# EAGLE design NAV_Doska_1 (EAGLE 7.2.0)
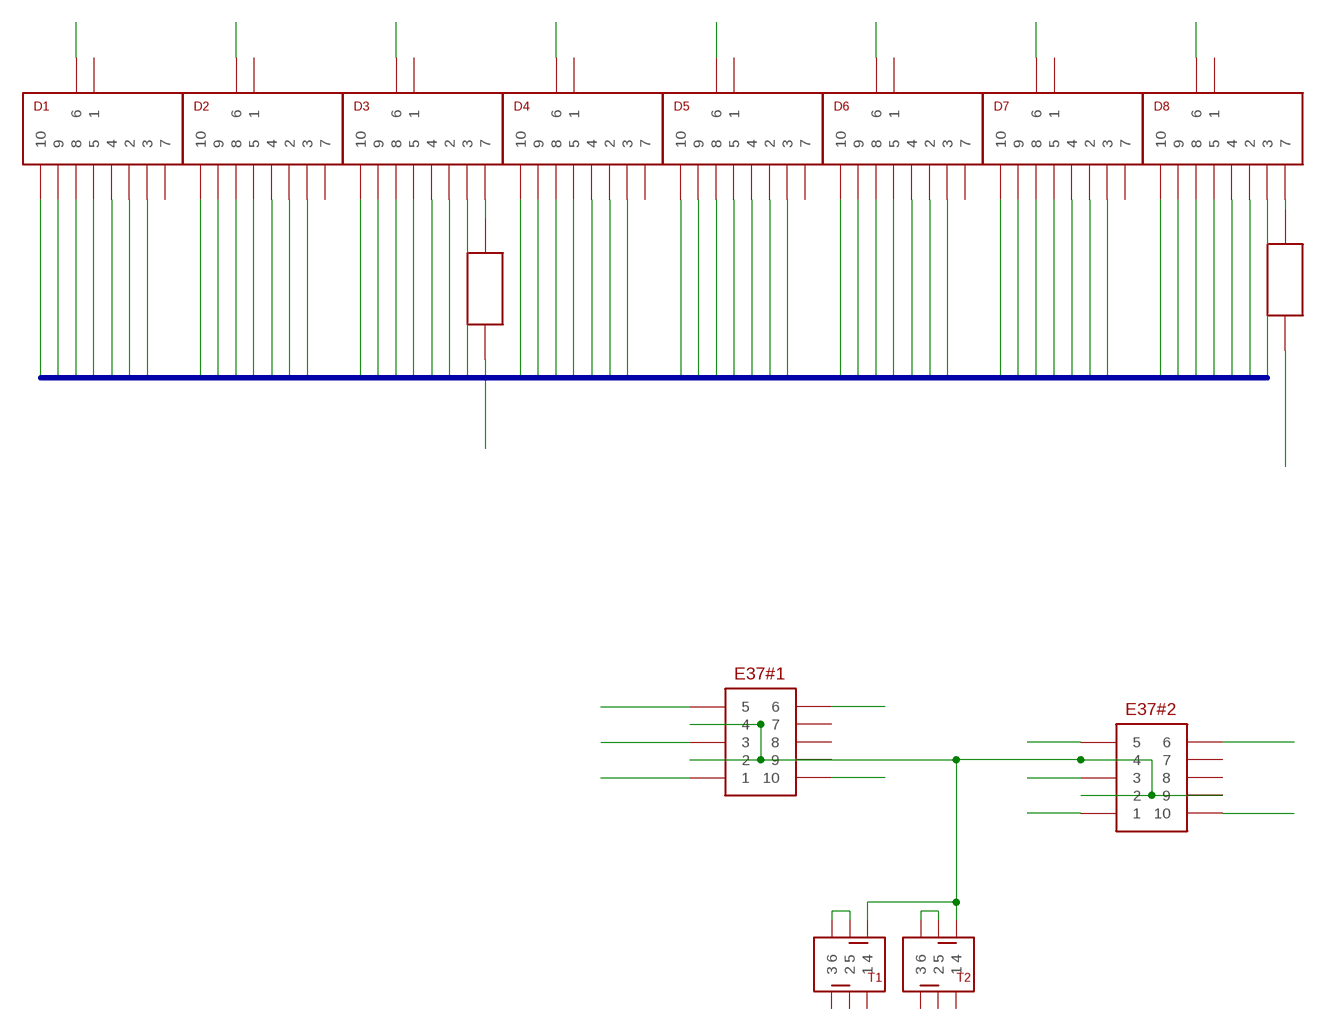
[diagram p0: schematic, sheet 1, part 1 of 2]
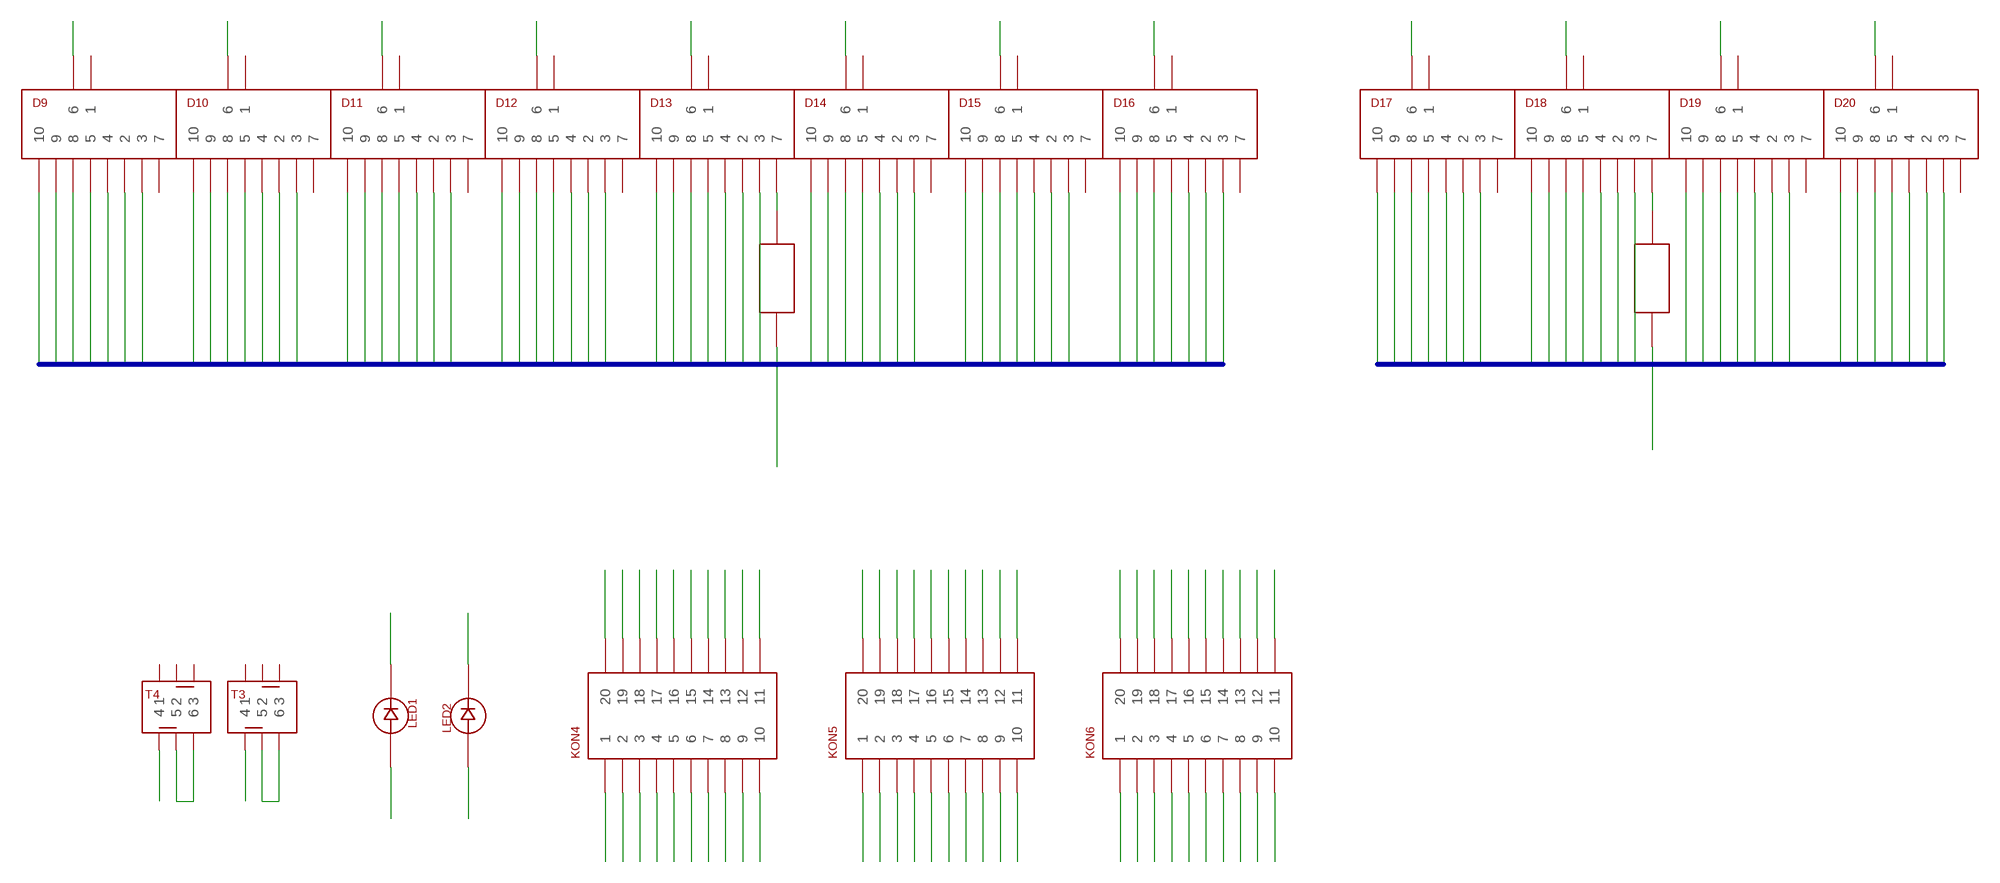
[diagram p1: schematic, sheet 1, part 2 of 2]

## Parts
D1  SA3611EWA  [SA3611EWA]
D2  SA3611EWA  [SA3611EWA]
D3  SA3611EWA  [SA3611EWA]
D4  SA3611EWA  [SA3611EWA]
D5  SA3611EWA  [SA3611EWA]
D6  SA3611EWA  [SA3611EWA]
D7  SA3611EWA  [SA3611EWA]
D8  SA3611EWA  [SA3611EWA]
D9  SA3611EWA  [SA3611EWA]
D10  SA3611EWA  [SA3611EWA]
D11  SA3611EWA  [SA3611EWA]
D12  SA3611EWA  [SA3611EWA]
D13  SA3611EWA  [SA3611EWA]
D14  SA3611EWA  [SA3611EWA]
D15  SA3611EWA  [SA3611EWA]
D16  SA3611EWA  [SA3611EWA]
D17  SA3611EWA  [SA3611EWA]
D18  SA3611EWA  [SA3611EWA]
D19  SA3611EWA  [SA3611EWA]
D20  SA3611EWA  [SA3611EWA]
E37#1  ELMA_E37  [ELMA_E37]
E37#2  ELMA_E37  [ELMA_E37]
KON4  LISTA_2X10  [LISTA_2X10]
KON5  LISTA_2X10  [LISTA_2X10]
KON6  LISTA_2X10  [LISTA_2X10]
LED1  LED_5MM  [LED_5MM]
LED2  LED_5MM  [LED_5MM]
T1  P1-0S  [P1-0S]
T2  P1-0S  [P1-0S]
T3  P1-0S  [P1-0S]
T4  P1-0S  [P1-0S]
U$1  REZISTOR  [REZISTOR]
U$2  REZISTOR  [REZISTOR]
U$3  REZISTOR  [REZISTOR]
U$4  REZISTOR  [REZISTOR]

## Nets
D1: D1.6 KON4.1
D2: D2.6 KON4.2
D3: D3.6 KON4.9
D4: D4.6 KON4.6
D5: D5.6 KON4.3
D6: D6.6 KON4.8
D7: D7.6 KON4.7
D8: D8.6 KON4.4
D9: D9.6 KON5.1
D10: D10.6 KON5.2
D11: D11.6 KON5.9
D12: D12.6 KON5.6
D13: D13.6 KON5.3
D14: D14.6 KON5.8
D15: D15.6 KON5.7
D16: D16.6 KON5.4
D17: D17.6 KON6.1
D18: D18.6 KON6.2
D19: D19.6 KON6.9
D20: D20.6 KON6.6
DRIVER1_SEG2: D1.2 D2.2 D3.2 D4.2 D5.2 D6.2 D7.2 D8.2 KON4.10
DRIVER1_SEG3: D1.3 D2.3 D3.3 D4.3 D5.3 D6.3 D7.3 D8.3 KON4.12
DRIVER1_SEG4: D1.4 D2.4 D3.4 D4.4 D5.4 D6.4 D7.4 D8.4 KON4.15
DRIVER1_SEG5: D1.5 D2.5 D3.5 D4.5 D5.5 D6.5 D7.5 D8.5 KON4.16
DRIVER1_SEG8: D1.8 D2.8 D3.8 D4.8 D5.8 D6.8 D7.8 D8.8 KON4.14
DRIVER1_SEG9: D1.9 D2.9 D3.9 D4.9 D5.9 D6.9 D7.9 D8.9 KON4.11
DRIVER1_SEG10: D1.10 D2.10 D3.10 D4.10 D5.10 D6.10 D7.10 D8.10 KON4.13
DRIVER2_SEG2: D9.2 D10.2 D11.2 D12.2 D13.2 D14.2 D15.2 D16.2 KON5.10
DRIVER2_SEG3: D9.3 D10.3 D11.3 D12.3 D13.3 D14.3 D15.3 D16.3 KON5.12
DRIVER2_SEG4: D9.4 D10.4 D11.4 D12.4 D13.4 D14.4 D15.4 D16.4 KON5.15
DRIVER2_SEG5: D9.5 D10.5 D11.5 D12.5 D13.5 D14.5 D15.5 D16.5 KON5.16
DRIVER2_SEG8: D9.8 D10.8 D11.8 D12.8 D13.8 D14.8 D15.8 D16.8 KON5.14
DRIVER2_SEG9: D9.9 D10.9 D11.9 D12.9 D13.9 D14.9 D15.9 D16.9 KON5.11
DRIVER2_SEG10: D9.10 D10.10 D11.10 D12.10 D13.10 D14.10 D15.10 D16.10 KON5.13
DRIVER3_SEG2: D17.2 D18.2 D19.2 D20.2 KON6.10
DRIVER3_SEG3: D17.3 D18.3 D19.3 D20.3 KON6.12
DRIVER3_SEG4: D17.4 D18.4 D19.4 D20.4 KON6.15
DRIVER3_SEG5: D17.5 D18.5 D19.5 D20.5 KON6.16 LED1.P$2 LED2.P$2
DRIVER3_SEG8: D17.8 D18.8 D19.8 D20.8 KON6.14
DRIVER3_SEG9: D17.9 D18.9 D19.9 D20.9 KON6.11
DRIVER3_SEG10: D17.10 D18.10 D19.10 D20.10 KON6.13
E37#1_1: E37#1.1 KON4.17
E37#1_3: E37#1.3 KON4.18
E37#1_5: E37#1.5 KON4.20
E37#1_6: E37#1.6 KON4.19
E37#1_10: E37#1.10 KON4.5
E37#2_1: E37#2.1 KON6.17
E37#2_3: E37#2.3 KON6.18
E37#2_5: E37#2.5 KON6.20
E37#2_6: E37#2.6 KON6.19
E37#2_10: E37#2.10 KON6.5
GND: E37#1.2 E37#1.4 E37#1.9 E37#2.2 E37#2.4 E37#2.9 KON5.5 T1.4 T2.4 T3.5 T3.6 T4.5 T4.6 U$1.P$1 U$2.P$1 U$3.P$1 U$4.P$1
LED1: KON6.3 LED1.P$1
LED2: KON6.8 LED2.P$1
N$2: D3.7 U$4.P$2
N$3: D18.7 U$2.P$2
N$4: D13.7 U$1.P$2
N$5: D8.7 U$3.P$2
N$33: KON6.4
N$42: KON6.7
T1: KON5.20 T1.5 T1.6
T2: KON5.19 T2.5 T2.6
T3: KON5.18 T3.4
T4: KON5.17 T4.4
Unconnected: D1.1 D1.7 D2.1 D2.7 D3.1 D4.1 D4.7 D5.1 D5.7 D6.1 D6.7 D7.1 D7.7 D8.1 D9.1 D9.7 D10.1 D10.7 D11.1 D11.7 D12.1 D12.7 D13.1 D14.1 D14.7 D15.1 D15.7 D16.1 D16.7 D17.1 D17.7 D18.1 D19.1 D19.7 D20.1 D20.7 E37#1.7 E37#1.8 E37#2.7 E37#2.8 T1.1 T1.2 T1.3 T2.1 T2.2 T2.3 T3.1 T3.2 T3.3 T4.1 T4.2 T4.3

## Buses
B$1
B$2
B$3

## Library data of the parts
D1-D20 = RadioStack_v2:SA3611EWA
E37#1 E37#2 = RadioStack_v2:ELMA_E37
KON4-KON6 = RadioStack_v2:LISTA_2X10
LED1 LED2 = RadioStack_v2:LED_5MM
T1-T4 = RadioStack_v2:P1-0S
U$1-U$4 = RadioStack_v2:REZISTOR

## Board
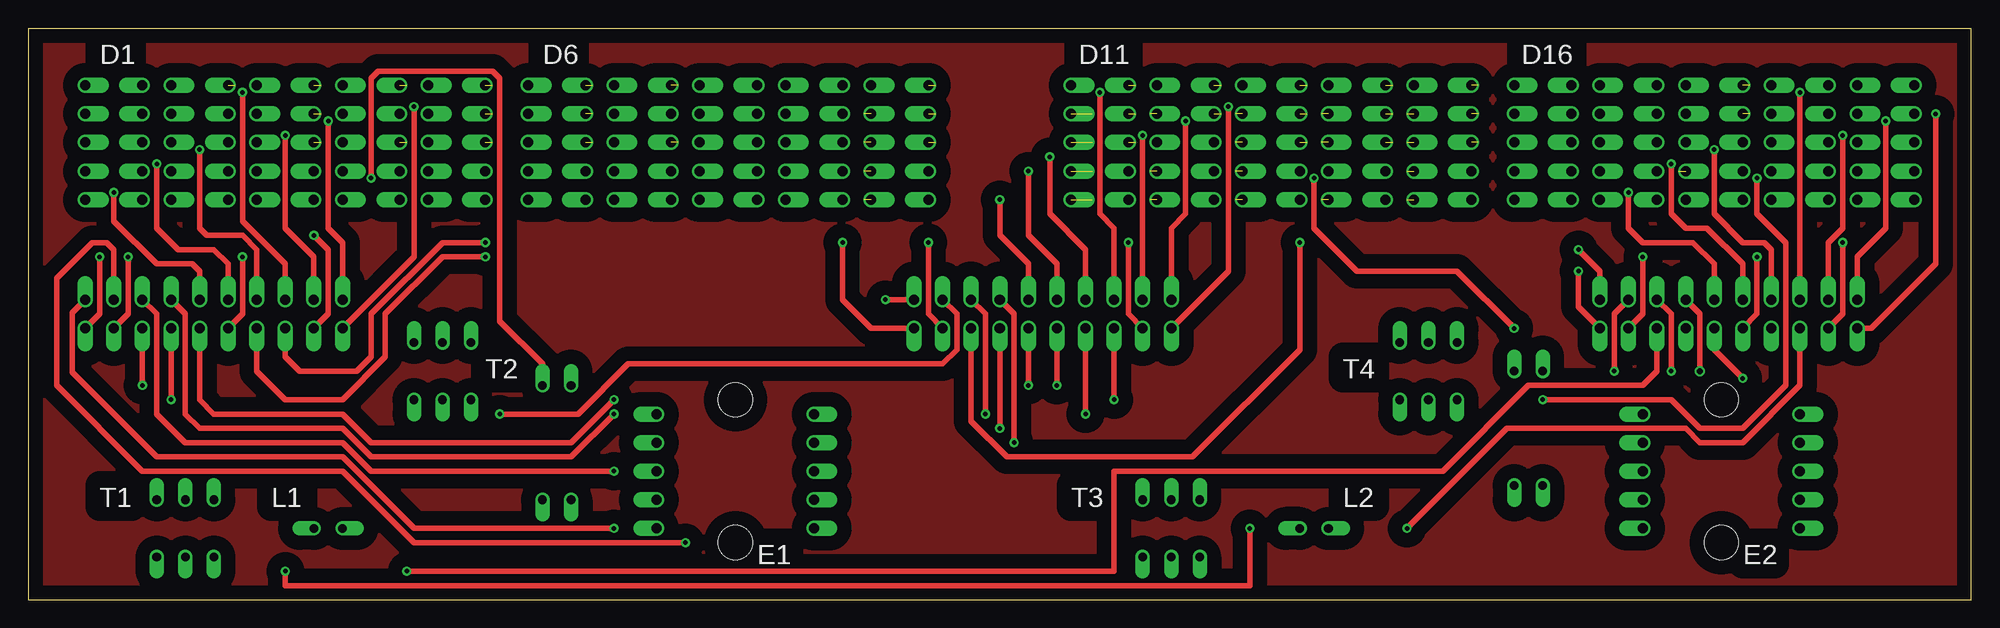
[diagram p2: board, top side]
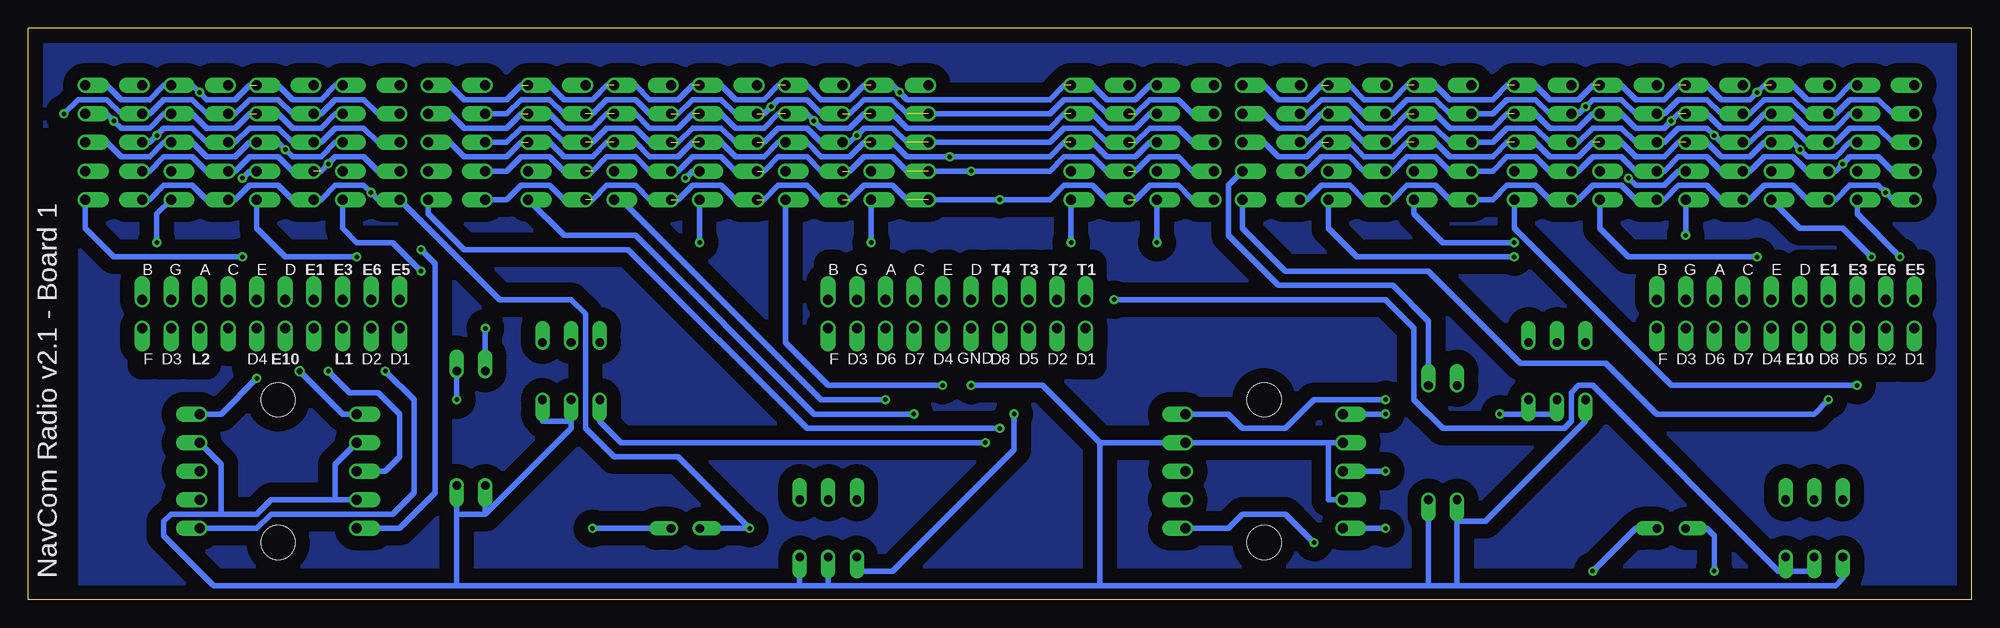
[diagram p3: board, bottom side, seen from below]

Size 172.72 x 50.8 mm. Coordinates in mm from the lower left corner, seen from the top.
Outline: 0,50.8 0,0 172.72,0 172.72,50.8 0,50.8
Copper layers (1*16): Top 0.035mm / dielectric 1.5mm / Bottom 0.035mm
Design rules "RadioStack_v2 *": minimum track width 0.2mm, minimum drill 0.4mm, track to track 0.2mm, track to pad 0.2mm, pad to pad 0.2mm, via to via 0.2mm, smd to smd 0.2mm, copper to edge 0.5mm, drill to drill 8mil, minimum pad ring 10mil, minimum via ring 8mil, stop-mask expansion 4mil, vias tented up to drill 0mil, thermal gap 10mil
tRestrict: area 6.3,8.3 to 9.2,10.2; area 40.6,19.7 to 43.5,21.6; area 92.7,8.3 to 95.6,10.2; area 116.8,19.7 to 119.7,21.6; area 6.3,47.6 to 9.2,49.5; area 45.7,47.6 to 48.6,49.5; area 93.3,47.6 to 97.8,49.5; area 132.7,47.6 to 137.3,49.5; area 21.6,8.3 to 24.4,10.2; area 116.8,8.3 to 119.7,10.2; area 64.8,3.2 to 67.6,5.1; area 152.4,3.2 to 155.3,5.1
bRestrict: area 7,20.6 to 8.6,21.9; area 9.5,20.6 to 11.1,21.9; area 12.1,20.6 to 13.7,21.9; area 14.2,20.9 to 16.8,21.9; area 17.1,20.6 to 18.7,21.9; area 4.4,20.6 to 6,21.9; area 7,28.8 to 8.6,29.8; area 9.5,28.8 to 11.1,29.8; area 12.1,28.8 to 13.7,29.8; area 14.6,28.8 to 15.3,29.8; area 17.1,28.8 to 17.8,29.8; area 4.4,28.8 to 6,29.8; 47 more areas

### Footprints (pad centres in the part's own frame; a part is rotated, then mirrored left to right if it is on the bottom)
SA3611EWA = drill 0.889 pad 1.27 offset: 1 0,0; 2 0,-2.54; 3 0,-5.08; 4 0,-7.62; 5 0,-10.16; 6 5.08,-10.16; 7 5.08,-7.62; 8 5.08,-5.08; 9 5.08,-2.54; 10 5.08,0
ELMA_E37 = drill 0.889 pad 1.27 offset: 1 0,0; 2 0,-2.54; 3 0,-5.08; 4 0,-7.62; 5 0,-10.16; 6 13.97,-10.16; 7 13.97,-7.62; 8 13.97,-5.08; 9 13.97,-2.54; 10 13.97,0 | hole 3.048: 6.985,1.27; 6.985,-11.43
LISTA_2X10 = drill 0.889 pad 1.27 offset: 1 0,0; 2 0,-2.54; 3 0,-5.08; 4 0,-7.62; 5 0,-10.16; 6 0,-12.7; 7 0,-15.24; 8 0,-17.78; 9 0,-20.32; 10 0,-22.86; 11 2.54,-22.86; 12 2.54,-20.32; 13 2.54,-17.78; 14 2.54,-15.24; 15 2.54,-12.7; 16 2.54,-10.16; 17 2.54,-7.62; 18 2.54,-5.08; 19 2.54,-2.54; 20 2.54,0
LED_5MM = drill 0.762 pad 1.27 offset: P$1 2.54,0; P$2 0,0
P1-0S = drill 0.762 pad 1.27 offset: 1 0,0; 2 2.54,0; 3 5.08,0; 4 0,-5.08; 5 2.54,-5.08; 6 5.08,-5.08
REZISTOR = drill 0.762 pad 1.27 offset: P$1 -5.08,0; P$2 5.08,0

### Placement (x,y rotation side)
D1  5.08,45.72 0 top
D2  12.7,45.72 0 top
D3  20.32,45.72 0 top
D4  27.94,45.72 0 top
D5  35.56,45.72 0 top
D6  44.45,45.72 0 top
D7  52.07,45.72 0 top
D8  59.69,45.72 0 top
D9  67.31,45.72 0 top
D10  74.93,45.72 0 top
D11  92.71,45.72 0 top
D12  100.33,45.72 0 top
D13  107.95,45.72 0 top
D14  115.57,45.72 0 top
D15  123.19,45.72 0 top
D16  132.08,45.72 0 top
D17  139.7,45.72 0 top
D18  147.32,45.72 0 top
D19  154.94,45.72 0 top
D20  162.56,45.72 0 top
E37#1  55.88,16.51 0 top
E37#2  143.51,16.51 0 top
KON4  5.08,24.13 90 top
KON5  78.74,24.13 90 top
KON6  139.7,24.13 90 top
LED1  25.4,6.35 0 top
LED2  113.03,6.35 0 top
T1  11.43,8.89 0 top
T2  34.29,22.86 0 top
T3  99.06,8.89 0 top
T4  121.92,22.86 0 top
U$1  132.08,15.24 90 top
U$2  134.62,15.24 90 top
U$3  48.26,13.97 90 top
U$4  45.72,13.97 90 top

### Tracks (layer width: path | path; a pad name or v marks a point on that pad's centre or on a via)
D1  (via drill 0.4 pad 0.5)
  Top 0.508: v6.35,30.48 6.35,25.4 KON4.1
  Bottom 0.508: D1.6 10.16,34.29 v6.35,30.48
D2  (via drill 0.4 pad 0.5)
  Top 0.508: v8.89,30.48 8.89,25.4 KON4.2
  Bottom 0.508: D2.6 15.24,33.02 11.43,33.02 v8.89,30.48
D3  (via drill 0.4 pad 0.5)
  Top 0.508: KON4.9 26.67,25.4 26.67,31.11 v25.4,32.38
  Bottom 0.508: v25.4,32.38 D3.6
D4  (via drill 0.4 pad 0.5)
  Top 0.508: KON4.6 19.05,25.4 v19.05,30.48
  Bottom 0.508: D4.6 33.02,33.02 30.48,30.48 v19.05,30.48
D5  (via drill 0.4 pad 0.5)
  Top 0.508: KON4.3 v10.16,19.05
  Bottom 0.508: v10.16,19.05 26.67,19.05 40.64,33.02 D5.6
D6  (via drill 0.4 pad 0.5)
  Top 0.508: KON4.8 22.86,21.59 24.13,20.32 29.21,20.32 30.48,21.59 30.48,25.4 36.83,31.75 v40.64,31.75
  Bottom 0.508: D6.6 49.53,34.29 46.99,31.75 v40.64,31.75
D7  (via drill 0.4 pad 0.5)
  Top 0.508: KON4.7 20.32,20.32 22.86,17.78 27.94,17.78 31.75,21.59 31.75,25.4 36.83,30.48 v40.64,30.48
  Bottom 0.508: v40.64,30.48 54.61,30.48 57.15,33.02 D7.6
D8  (via drill 0.4 pad 0.5)
  Top 0.508: KON4.4 v12.7,17.78
  Bottom 0.508: v12.7,17.78 13.97,16.51 27.94,16.51 32.47,21.04 40.09,21.04 48.26,29.21 60.96,29.21 64.77,33.02 D8.6
D9  (via drill 0.4 pad 0.5)
  Top 0.508: v72.39,31.75 72.39,26.67 74.93,24.13 KON5.1
  Bottom 0.508: D9.6 v72.39,31.75
D10  (via drill 0.4 pad 0.5)
  Top 0.508: v80.01,31.75 80.01,25.4 KON5.2
  Bottom 0.508: D10.6 v80.01,31.75
D11  (via drill 0.4 pad 0.5)
  Top 0.508: KON5.9 97.79,25.4 v97.79,31.75
  Bottom 0.508: D11.6 v97.79,31.75
D12  (via drill 0.4 pad 0.5)
  Top 0.508: KON5.6 v91.44,19.05
  Bottom 0.508: v91.44,19.05 101.6,19.05 105.41,22.86 D12.6
D13  (via drill 0.4 pad 0.5)
  Top 0.508: KON5.3 83.82,15.88 87,12.7 103.5,12.7 113.03,22.23 v113.03,31.75
  Bottom 0.508: D13.6 v113.03,31.75
D14  (via drill 0.4 pad 0.5)
  Top 0.508: v96.52,17.78 KON5.8
  Bottom 0.508: D14.6 120.02,35.56 102.23,17.78 v96.52,17.78
D15  (via drill 0.4 pad 0.5)
  Top 0.508: KON5.7 v93.98,16.51
  Bottom 0.508: v93.98,16.51 102.87,16.51 118.75,32.38 125.09,32.38 D15.6
D16  (via drill 0.4 pad 0.5)
  Top 0.508: KON5.4 v86.36,15.24
  Bottom 0.508: D16.6 137.16,34.29 133.99,31.11 119.38,31.11 103.5,15.24 v86.36,15.24
D17  (via drill 0.4 pad 0.5)
  Top 0.508: v137.79,29.21 137.79,26.04 KON6.1
  Bottom 0.508: D17.6 144.78,33.02 143.51,31.75 140.34,31.75 v137.79,29.21
D18  (via drill 0.4 pad 0.5)
  Top 0.508: v143.51,30.48 143.51,25.4 KON6.2
  Bottom 0.508: v143.51,30.48 149.86,30.48 152.4,33.02 D18.6
D19  (via drill 0.4 pad 0.5)
  Top 0.508: v161.29,31.75 161.29,25.4 KON6.9
  Bottom 0.508: D19.6 161.29,34.29 v161.29,31.75
D20  (via drill 0.4 pad 0.5)
  Top 0.508: v153.67,30.48 153.67,25.4 KON6.6
  Bottom 0.508: D20.6 167.64,33.02 165.1,30.48 v153.67,30.48
DRIVER1_SEG2  (via drill 0.4 pad 0.5)
  Top 0.508: KON4.10 34.29,30.48 v34.29,43.81
  Bottom 0.508: D1.2 6.99,43.18 8.26,44.45 10.79,44.45 12.06,43.18 D2.2 14.61,43.18 15.88,44.45 18.41,44.45 19.68,43.18 D3.2 22.23,43.18 23.5,44.45 26.04,44.45 27.3,43.18 D4.2 29.84,43.18 31.11,44.45 33.66,44.45 v34.29,43.81 34.92,43.18 D5.2 37.47,43.18 38.73,44.45 41.27,44.45 42.55,43.18 D6.2 46.35,43.18 47.62,44.45 50.16,44.45 51.44,43.18 D7.2 53.98,43.18 55.24,44.45 57.78,44.45 59.05,43.18 D8.2
DRIVER1_SEG3  (via drill 0.4 pad 0.5)
  Top 0.508: KON4.12 25.4,30.48 22.86,33.02 v22.86,41.27
  Bottom 0.508: D8.3 59.05,40.64 57.78,41.91 55.24,41.91 53.98,40.64 D7.3 51.44,40.64 50.16,41.91 47.62,41.91 46.35,40.64 D6.3 42.55,40.64 41.27,41.91 38.73,41.91 37.47,40.64 D5.3 34.92,40.64 33.66,41.91 31.11,41.91 29.84,40.64 D4.3 27.3,40.64 26.04,41.91 23.5,41.91 v22.86,41.27 22.23,40.64 D3.3 19.68,40.64 18.41,41.91 15.88,41.91 14.61,40.64 D2.3 12.06,40.64 10.79,41.91 8.26,41.91 6.99,40.64 D1.3
DRIVER1_SEG4  (via drill 0.4 pad 0.5)
  Top 0.508: KON4.15 17.78,29.84 16.51,31.11 13.34,31.11 11.43,33.02 v11.43,38.73
  Bottom 0.508: D1.4 6.99,38.1 8.26,39.37 10.79,39.37 v11.43,38.73 12.06,38.1 D2.4 14.61,38.1 15.88,39.37 18.41,39.37 19.68,38.1 D3.4 22.23,38.1 23.5,39.37 26.04,39.37 27.3,38.1 D4.4 29.84,38.1 31.11,39.37 33.66,39.37 34.92,38.1 D5.4 37.47,38.1 38.73,39.37 41.27,39.37 42.55,38.1 D6.4 46.35,38.1 47.62,39.37 50.16,39.37 51.44,38.1 D7.4 53.98,38.1 55.24,39.37 57.78,39.37 59.05,38.1 D8.4
DRIVER1_SEG5  (via drill 0.4 pad 0.5)
  Top 0.508: KON4.16 15.24,29.21 14.61,29.84 11.43,29.84 7.62,33.66 v7.62,36.2
  Bottom 0.508: D8.5 59.05,35.56 57.78,36.83 55.24,36.83 53.98,35.56 D7.5 51.44,35.56 50.16,36.83 47.62,36.83 46.35,35.56 D6.5 42.55,35.56 41.27,36.83 38.73,36.83 37.47,35.56 D5.5 34.92,35.56 33.66,36.83 31.11,36.83 29.84,35.56 D4.5 27.3,35.56 26.04,36.83 23.5,36.83 22.23,35.56 D3.5 19.68,35.56 18.41,36.83 15.88,36.83 14.61,35.56 D2.5 12.06,35.56 10.79,36.83 8.26,36.83 v7.62,36.2 6.99,35.56 D1.5
DRIVER1_SEG8  (via drill 0.4 pad 0.5)  (5 unrouted)
  Top 0.508: KON4.14 20.32,31.11 19.05,32.38 15.88,32.38 15.24,33.02 v15.24,40.01
  Bottom 0.508: D8.8 62.87,40.64 61.59,39.37 59.05,39.37 57.78,40.64 55.24,40.64 53.98,39.37 51.44,39.37 50.16,40.64 47.62,40.64 46.35,39.37 42.55,39.37 41.27,40.64 38.73,40.64 37.47,39.37 34.92,39.37 33.66,40.64 31.11,40.64 29.84,39.37 27.3,39.37 26.04,40.64 23.5,40.64 22.23,39.37 19.68,39.37 18.41,40.64 D2.8 15.88,40.64 v15.24,40.01 14.61,39.37 12.06,39.37 10.79,40.64 D1.8
DRIVER1_SEG9  (via drill 0.4 pad 0.5)  (3 unrouted)
  Top 0.508: KON4.11 27.94,31.75 26.67,33.02 v26.67,42.55
  Bottom 0.508: D1.9 10.79,43.18 12.06,41.91 14.61,41.91 15.88,43.18 D2.9 18.41,43.18 19.68,41.91 22.23,41.91 23.5,43.18 26.04,43.18 v26.67,42.55 27.3,41.91 29.84,41.91 31.11,43.18 D4.9 33.66,43.18 34.92,41.91 37.47,41.91 38.73,43.18 41.27,43.18 42.55,41.91 46.35,41.91 47.62,43.18 50.16,43.18 51.44,41.91 53.98,41.91 55.24,43.18 D7.9 57.78,43.18 59.05,41.91 61.59,41.91 62.87,43.18 D8.9
DRIVER1_SEG10  (via drill 0.4 pad 0.5)  (6 unrouted)
  Top 0.508: KON4.13 22.86,29.84 19.05,33.66 v19.05,45.09
  Bottom 0.508: D8.10 62.87,45.72 61.59,44.45 59.05,44.45 57.78,45.72 55.24,45.72 53.98,44.45 51.44,44.45 50.16,45.72 47.62,45.72 46.35,44.45 42.55,44.45 41.27,45.72 38.73,45.72 37.47,44.45 34.92,44.45 33.66,45.72 31.11,45.72 29.84,44.45 27.3,44.45 26.04,45.72 23.5,45.72 22.23,44.45 19.68,44.45 v19.05,45.09 18.41,45.72 15.88,45.72 14.61,44.45 12.06,44.45 10.79,45.72 D1.10
DRIVER2_SEG2  (via drill 0.4 pad 0.5)  (6 unrouted)
  Top 0.508: KON5.10 106.68,29.21 v106.68,43.81
  Bottom 0.508: D9.2 69.22,43.18 70.48,44.45 73.03,44.45 74.3,43.18 76.83,43.18 78.11,44.45 80.64,44.45 81.92,43.18 94.61,43.18 95.89,44.45 98.42,44.45 99.69,43.18 102.23,43.18 103.5,44.45 106.05,44.45 v106.68,43.81 107.31,43.18 109.86,43.18 111.12,44.45 113.67,44.45 114.94,43.18 117.47,43.18 118.75,44.45 121.28,44.45 122.56,43.18 125.09,43.18 126.36,44.45 128.91,44.45 130.18,43.18 D16.2
DRIVER2_SEG3  (via drill 0.4 pad 0.5)  (5 unrouted)
  Top 0.508: KON5.12 v99.06,41.27
  Bottom 0.508: D9.3 69.22,40.64 70.48,41.91 73.03,41.91 74.3,40.64 76.83,40.64 78.11,41.91 80.64,41.91 81.92,40.64 94.61,40.64 95.89,41.91 98.42,41.91 v99.06,41.27 99.69,40.64 D12.3 102.23,40.64 103.5,41.91 106.05,41.91 107.31,40.64 109.86,40.64 111.12,41.91 113.67,41.91 114.94,40.64 117.47,40.64 118.75,41.91 121.28,41.91 122.56,40.64 125.09,40.64 126.36,41.91 128.91,41.91 130.18,40.64 D16.3
DRIVER2_SEG4  (via drill 0.4 pad 0.5)  (5 unrouted)
  Top 0.508: KON5.15 91.44,29.84 88.9,32.38 v88.9,38.1
  Bottom 0.508: D9.4 69.22,38.1 70.48,39.37 73.03,39.37 74.3,38.1 76.83,38.1 78.11,39.37 80.64,39.37 81.92,38.1 v88.9,38.1 94.61,38.1 95.89,39.37 98.42,39.37 99.69,38.1 102.23,38.1 103.5,39.37 106.05,39.37 107.31,38.1 109.86,38.1 111.12,39.37 113.67,39.37 114.94,38.1 D14.4 117.47,38.1 118.75,39.37 121.28,39.37 122.56,38.1 125.09,38.1 126.36,39.37 128.91,39.37 130.18,38.1 D16.4
DRIVER2_SEG5  (via drill 0.4 pad 0.5)  (6 unrouted)
  Top 0.508: KON5.16 88.9,29.84 86.36,32.38 v86.36,35.56
  Bottom 0.508: D9.5 69.22,35.56 70.48,36.83 73.03,36.83 74.3,35.56 76.83,35.56 78.11,36.83 80.64,36.83 81.92,35.56 v86.36,35.56 94.61,35.56 95.89,36.83 98.42,36.83 99.69,35.56 102.23,35.56 103.5,36.83 106.05,36.83 107.31,35.56 109.86,35.56 111.12,36.83 113.67,36.83 114.94,35.56 117.47,35.56 118.75,36.83 121.28,36.83 122.56,35.56 125.09,35.56 126.36,36.83 128.91,36.83 130.18,35.56 D16.5
DRIVER2_SEG8  (via drill 0.4 pad 0.5)  (5 unrouted)
  Top 0.508: KON5.14 93.98,31.11 90.81,34.29 v90.81,39.37
  Bottom 0.508: D16.8 135.25,40.64 133.99,39.37 130.18,39.37 128.91,40.64 126.36,40.64 125.09,39.37 122.56,39.37 121.28,40.64 118.75,40.64 117.47,39.37 114.94,39.37 113.67,40.64 111.12,40.64 109.86,39.37 107.31,39.37 106.05,40.64 D12.8 103.5,40.64 102.23,39.37 99.69,39.37 98.42,40.64 95.89,40.64 94.61,39.37 v90.81,39.37 81.92,39.37 80.64,40.64 78.11,40.64 76.83,39.37 74.3,39.37 73.03,40.64 D9.8
DRIVER2_SEG9  (via drill 0.4 pad 0.5)  (6 unrouted)
  Top 0.508: KON5.11 101.6,33.02 102.87,34.29 v102.87,42.55
  Bottom 0.508: D16.9 135.25,43.18 133.99,41.91 130.18,41.91 128.91,43.18 126.36,43.18 125.09,41.91 122.56,41.91 121.28,43.18 118.75,43.18 117.47,41.91 114.94,41.91 113.67,43.18 111.12,43.18 109.86,41.91 107.31,41.91 106.05,43.18 103.5,43.18 v102.87,42.55 102.23,41.91 99.69,41.91 98.42,43.18 95.89,43.18 94.61,41.91 81.92,41.91 80.64,43.18 78.11,43.18 76.83,41.91 74.3,41.91 73.03,43.18 D9.9
DRIVER2_SEG10  (via drill 0.4 pad 0.5)  (6 unrouted)
  Top 0.508: KON5.13 96.52,33.02 95.25,34.29 v95.25,45.09
  Bottom 0.508: D16.10 135.25,45.72 133.99,44.45 130.18,44.45 128.91,45.72 126.36,45.72 125.09,44.45 122.56,44.45 121.28,45.72 118.75,45.72 117.47,44.45 114.94,44.45 113.67,45.72 111.12,45.72 109.86,44.45 107.31,44.45 106.05,45.72 103.5,45.72 102.23,44.45 99.69,44.45 98.42,45.72 95.89,45.72 v95.25,45.09 94.61,44.45 81.92,44.45 80.64,45.72 78.11,45.72 76.83,44.45 74.3,44.45 73.03,45.72 D9.10
DRIVER3_SEG2  (via drill 0.4 pad 0.5)
  Top 0.508: KON6.10 163.83,24.13 169.54,29.84 v169.54,43.18
  Bottom 0.508: D17.2 141.6,43.18 142.88,44.45 145.41,44.45 146.69,43.18 D18.2 149.22,43.18 150.5,44.45 153.03,44.45 154.31,43.18 D19.2 156.84,43.18 158.12,44.45 160.66,44.45 161.93,43.18 D20.2 164.47,43.18 165.74,44.45 168.28,44.45 v169.54,43.18
DRIVER3_SEG3  (via drill 0.4 pad 0.5)
  Top 0.508: KON6.12 160.02,31.75 161.29,33.02 v161.29,41.27
  Bottom 0.508: D17.3 141.6,40.64 142.88,41.91 145.41,41.91 146.69,40.64 D18.3 149.22,40.64 150.5,41.91 153.03,41.91 154.31,40.64 D19.3 156.84,40.64 158.12,41.91 160.66,41.91 v161.29,41.27 161.93,40.64 D20.3
DRIVER3_SEG4  (via drill 0.4 pad 0.5)  (1 unrouted)
  Top 0.508: KON6.15 152.4,29.84 149.22,33.02 147.32,33.02 146.05,34.29 v146.05,38.73
  Bottom 0.508: D20.4 161.93,38.1 160.66,39.37 158.12,39.37 156.84,38.1 D19.4 154.31,38.1 153.03,39.37 150.5,39.37 149.22,38.1 146.69,38.1 v146.05,38.73 145.41,39.37 142.88,39.37 141.6,38.1 D17.4
DRIVER3_SEG5  (via drill 0.4 pad 0.5)
  Top 0.508: KON6.16 149.86,29.84 147.96,31.75 143.51,31.75 142.24,33.02 v142.24,36.2 | v108.58,6.35 108.58,1.27 22.86,1.27 v22.86,2.54
  Bottom 0.508: D20.5 161.93,35.56 160.66,36.83 158.12,36.83 156.84,35.56 D19.5 154.31,35.56 153.03,36.83 150.5,36.83 149.22,35.56 D18.5 146.69,35.56 145.41,36.83 142.88,36.83 v142.24,36.2 141.6,35.56 D17.5 130.81,26.67 124.46,26.67 123.19,25.4 123.19,15.24 120.65,12.7 114.94,12.7 v108.58,6.35 LED2.P$2 | LED1.P$2 23.5,6.35 22.86,5.71 v22.86,2.54
DRIVER3_SEG8  (via drill 0.4 pad 0.5)
  Top 0.508: KON6.14 154.94,31.11 154.31,31.75 152.4,31.75 149.86,34.29 v149.86,40.01
  Bottom 0.508: D20.8 165.74,40.64 164.47,39.37 161.93,39.37 160.66,40.64 D19.8 158.12,40.64 156.84,39.37 154.31,39.37 153.03,40.64 D18.8 150.5,40.64 v149.86,40.01 149.22,39.37 146.69,39.37 145.41,40.64 D17.8
DRIVER3_SEG9  (via drill 0.4 pad 0.5)  (1 unrouted)
  Top 0.508: KON6.11 162.56,30.48 165.1,33.02 v165.1,42.55
  Bottom 0.508: D20.9 165.74,43.18 v165.1,42.55 164.47,41.91 161.93,41.91 160.66,43.18 D19.9 158.12,43.18 156.84,41.91 154.31,41.91 153.03,43.18 150.5,43.18 149.22,41.91 146.69,41.91 145.41,43.18 D17.9
DRIVER3_SEG10  (via drill 0.4 pad 0.5)  (1 unrouted)
  Top 0.508: KON6.13 v157.48,45.09
  Bottom 0.508: D20.10 165.74,45.72 164.47,44.45 161.93,44.45 160.66,45.72 D19.10 158.12,45.72 v157.48,45.09 156.84,44.45 154.31,44.45 153.03,45.72 150.5,45.72 149.22,44.45 146.69,44.45 145.41,45.72 D17.10
E37#1_1  (via drill 0.4 pad 0.5)
  Top 0.508: KON4.17 13.97,25.4 13.97,16.51 15.24,15.24 27.94,15.24 30.48,12.7 48.26,12.7 v52.07,16.51
  Bottom 0.508: E37#1.1 v52.07,16.51
E37#1_3  (via drill 0.4 pad 0.5)
  Top 0.508: KON4.18 11.43,25.4 11.43,16.51 13.97,13.97 27.94,13.97 30.48,11.43 v52.07,11.43 v52.08,11.44
  Bottom 0.508: v52.07,11.43 E37#1.3
E37#1_5  (via drill 0.4 pad 0.5)
  Top 0.508: KON4.20 3.91,25.5 3.91,20.22 11.43,12.7 27.94,12.7 34.29,6.35 v52.07,6.35
  Bottom 0.508: E37#1.5 v52.07,6.35
E37#1_6  (via drill 0.4 pad 0.5)
  Top 0.508: v58.42,5.08 34.29,5.08 27.94,11.43 10.16,11.43 2.54,19.05 2.54,28.57 5.71,31.75 6.99,31.75 7.62,31.11 KON4.19
  Bottom 0.508: v58.42,5.08 60.96,7.62 64.77,7.62 66.04,6.35 E37#1.6
E37#1_10  (via drill 0.4 pad 0.5)
  Top 0.508: KON4.5 15.24,17.78 16.51,16.51 27.94,16.51 30.48,13.97 48.26,13.97 v52.07,17.78
  Bottom 0.508: v52.07,17.78 58.42,17.78 60.96,15.24 64.77,15.24 66.04,16.51 E37#1.10
E37#2_1  (via drill 0.51 pad 0.51)
  Top 0.508: KON6.17 148.59,25.4 v148.59,20.32
  Bottom 0.508: v148.59,20.32 144.78,16.51 E37#2.1
E37#2_3  (via drill 0.4 pad 0.5)
  Top 0.508: KON6.18 146.05,25.4 v146.05,20.32
  Bottom 0.508: v146.05,20.32 144.15,18.41 141.6,18.41 139.7,16.51 139.7,12.7 140.97,11.43 E37#2.3
E37#2_5  (via drill 0.4 pad 0.5)
  Top 0.508: KON6.20 139.7,29.21 v137.79,31.11
  Bottom 0.508: E37#2.5 139.7,6.35 136.53,9.53 136.53,29.84 v137.79,31.11
E37#2_6  (via drill 0.4 pad 0.5)
  Top 0.508: KON6.19 140.97,25.4 v140.97,20.32
  Bottom 0.508: E37#2.6 152.4,6.35 151.13,7.62 140.34,7.62 138.43,9.53 138.43,17.78 v140.97,20.32
E37#2_10  (via drill 0.4 pad 0.5)
  Top 0.508: v152.4,19.68 149.86,22.23 KON6.5
  Bottom 0.508: v152.4,19.68 155.57,16.51 E37#2.10
GND  (via drill 0.4 pad 0.5)
  Top 0.508: KON5.5 v88.9,19.05
  Bottom 0.508: E37#2.4 145.41,8.89 | 145.41,8.89 145.41,12.06 E37#2.2 | E37#1.4 57.15,8.89 57.15,13.97 | 57.15,13.97 E37#1.9 77.47,13.97 | E37#1.2 57.15,13.97 | 101.6,1.27 77.47,1.27 | 77.47,1.27 48.26,1.27 | 48.26,1.27 45.72,1.27 | 45.72,1.27 12.06,1.27 11.43,1.91 T1.4 | 101.6,1.27 104.14,1.27 | 104.14,1.27 134.62,1.27 | U$4.P$1 45.72,6.99 | 45.72,6.99 45.72,1.27 | U$3.P$1 48.26,1.27 | T3.5 101.6,1.27 | 155.57,7.62 152.4,7.62 151.13,8.89 145.41,8.89 | 155.57,7.62 160.02,7.62 160.66,6.99 160.66,5.71 156.21,1.27 134.62,1.27 | 134.62,7.62 134.62,1.27 | T4.5 124.46,15.88 | 124.46,15.88 124.46,15.24 132.08,7.62 | U$2.P$1 134.62,7.62 | 134.62,7.62 132.08,7.62 | 132.08,7.62 U$1.P$1 | T2.4 34.29,15.88 43.18,6.99 45.72,6.99 | v88.9,19.05 82.55,19.05 77.47,13.97 | 77.47,13.97 77.47,1.27 | T3.6 104.14,1.27 | T4.6 127,15.88 124.46,15.88 | E37#2.9 155.57,12.06 155.57,7.62
LED1  (via drill 0.4 pad 0.5)
  Top 0.508: KON6.3 144.78,20.32 143.51,19.05 133.35,19.05 125.73,11.43 96.52,11.43 96.52,2.54 v33.66,2.54
  Bottom 0.508: v33.66,2.54 29.84,6.35 LED1.P$1
LED2  (via drill 0.4 pad 0.5)
  Top 0.508: v122.56,6.35 131.44,15.24 147.32,15.24 148.59,13.97 152.4,13.97 157.48,19.05 KON6.8
  Bottom 0.508: v122.56,6.35 LED2.P$1
N$1
  pour Top (isolate 1.27): 1.27,49.53 1.27,1.27 171.45,1.27 171.45,49.53
N$2  (via drill 0.4 pad 0.5)
  Top 0.508: v30.48,37.47 30.48,46.35 31.11,46.99 41.27,46.99 41.91,46.35 41.91,24.77 45.72,20.95 U$4.P$2
  Bottom 0.508: D3.7 26.04,38.1 27.3,36.83 29.84,36.83 v30.48,37.47
N$3  (via drill 0.4 pad 0.5)
  Top 0.508: v153.67,37.47 153.67,34.29 156.21,31.75 156.21,19.05 152.4,15.24 148.59,15.24 146.05,17.78 v134.62,17.78
  Bottom 0.508: D18.7 153.03,38.1 v153.67,37.47 | U$2.P$2 v134.62,17.78
N$4  (via drill 0.4 pad 0.5)
  Top 0.508: v114.3,37.47 114.3,33.02 118.11,29.21 127,29.21 v132.08,24.13
  Bottom 0.508: v132.08,24.13 U$1.P$2 | D13.7 113.67,38.1 v114.3,37.47
N$5
  Bottom 0.508: D8.7 66.04,36.83 66.04,32.38 61.59,27.94 51.44,27.94 48.26,24.77 U$3.P$2
N$6
  pour Bottom (isolate 1.27): 1.27,49.53 1.27,1.27 171.45,1.27 171.45,49.53
T1  (via drill 0.4 pad 0.5)
  Top 0.508: v76.2,26.67 KON5.20
  Bottom 0.508: v76.2,26.67 52.07,26.67 49.53,24.13 49.53,17.78 46.99,15.24 36.2,15.24 35.56,15.88 35.56,18.41 34.92,19.05 33.66,19.05 17.14,2.54 16.51,2.54 | T1.5 13.97,2.54 16.51,2.54 | 16.51,2.54 T1.6
T2  (via drill 0.4 pad 0.5)
  Top 0.508: KON5.19 82.55,25.4 82.55,22.23 81.28,20.95 53.34,20.95 48.9,16.51 v41.91,16.51
  Bottom 0.508: v41.91,16.51 39.37,16.51 | T2.5 36.83,16.51 39.37,16.51 | 39.37,16.51 T2.6
T3  (via drill 0.4 pad 0.5)
  Top 0.508: KON5.18 85.09,25.4 v85.09,16.51
  Bottom 0.508: v85.09,16.51 85.09,13.34 95.89,2.54 99.06,2.54 T3.4
T4  (via drill 0.4 pad 0.5)
  Top 0.508: KON5.17 87.63,25.4 v87.63,13.97
  Bottom 0.508: T4.4 121.92,15.88 120.02,13.97 v87.63,13.97

### Text on the board
tPlace: D1 | D6 | D11 | D16 | T2 | T4 | T1 | L1 | T3 | L2 | E1 | E2
bPlace: E5 | E6 | E3 | E1 | D | E | C | A | G | B | T1 | T2 | T3 | T4 | D | E | C | A | G | B | E5 | E6 | E3 | E1 | D | E | C | A | G | B | D1 | D2 | D5 | D8 | E10 | D4 | D7 | D6 | D3 | F | D1 | D2 | D5 | D8 | D4 | D7 | D6 | D3 | F | D1 | D2 | L1 | E10 | D4 | L2 | D3 | F | GND | NavCom Radio v2.1 - Board 1